# Altium schematic sheet CPU_CIRCUIT.SchDoc
size A4
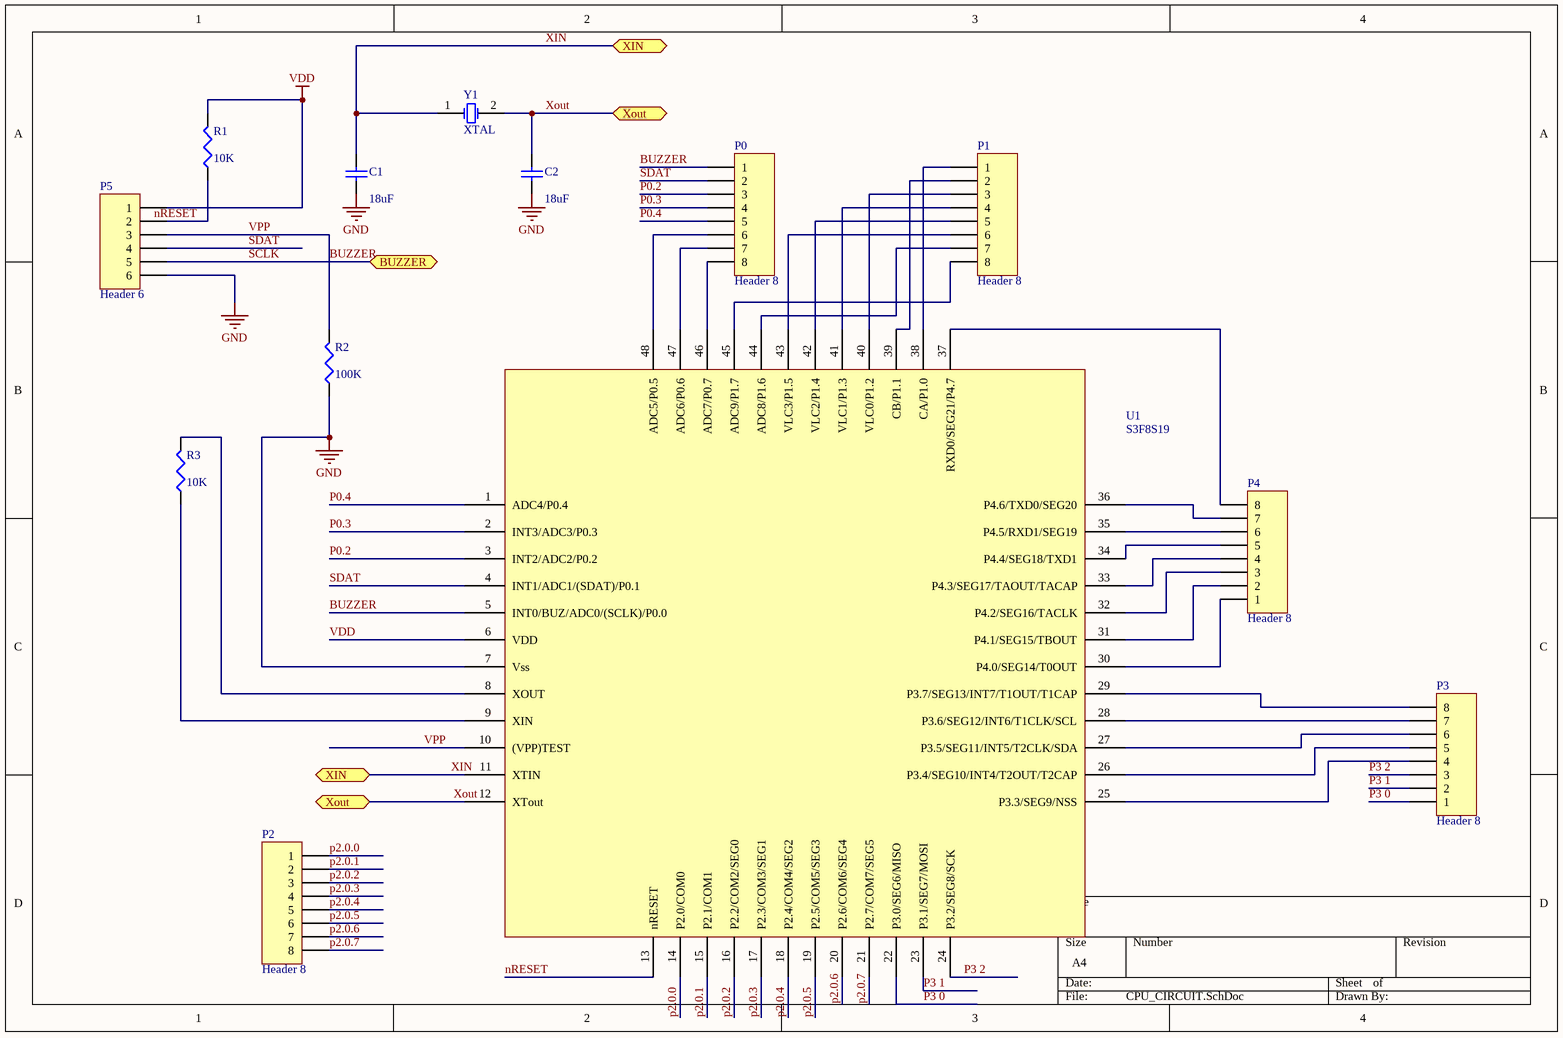
[diagram p0: CPU_CIRCUIT.SchDoc]

## Parts
C1  value 18uF  [1608[0603]]  (hidden comment: Cap Semi)
C2  value 18uF  [1608[0603]]  (hidden comment: Cap Semi)
P0  Header 8  [HDR1X8]
P1  Header 8  [HDR1X8]
P2  Header 8  [HDR1X8]
P3  Header 8  [HDR1X8]
P4  Header 8  [HDR1X8]
P5  Header 6  [HDR1X6]
R1  value 10K  [J1-0603]  (hidden comment: Res3)
R2  value 100K  [J1-0603]  (hidden comment: Res3)
R3  value 10K  [J1-0603]  (hidden comment: Res3)
U1  S3F8S19  [QFP75P1335X1335X230-48N]
Y1  XTAL  [R38]

## Ports
BUZZER, XIN, Xout

## Nets
GND: C1.1 C2.1 P5.6 R2.1 U1.7(Vss)
VDD: P5.1 R1.2 U1.6(VDD)
BUZZER: P0.1 P5.3 P5.5 R2.2 U1.5(INT0/BUZ/ADC0/(SCLK)/P0.0) U1.10((VPP)TEST) ; port BUZZER  [also labelled SCLK, VPP]
nRESET: U1.13(nRESET)
P0.2: P0.3 U1.3(INT2/ADC2/P0.2)
P0.3: P0.4 U1.2(INT3/ADC3/P0.3)
P0.4: P0.5 U1.1(ADC4/P0.4)
p2.0.0: P2.1 U1.14(P2.0/COM0)
p2.0.1: P2.2 U1.15(P2.1/COM1)
p2.0.2: P2.3 U1.16(P2.2/COM2/SEG0)
p2.0.3: P2.4 U1.17(P2.3/COM3/SEG1)
p2.0.4: P2.5 U1.18(P2.4/COM4/SEG2)
p2.0.5: P2.6 U1.19(P2.5/COM5/SEG3)
p2.0.6: P2.7 U1.20(P2.6/COM6/SEG4)
p2.0.7: P2.8 U1.21(P2.7/COM7/SEG5)
P3 0: P3.1 U1.22(P3.0/SEG6/MISO)
P3 1: P3.2 U1.23(P3.1/SEG7/MOSI)
P3 2: P3.3 U1.24(P3.2/SEG8/SCK)
SDAT: P0.2 P5.4 U1.4(INT1/ADC1/(SDAT)/P0.1)
XIN: C1.2 U1.11(XTIN) Y1.1(OSC1) ; port XIN
Xout: C2.2 U1.12(XTout) Y1.2(OSC2) ; port Xout
NetP0_6: P0.6 U1.48(ADC5/P0.5)
NetP0_7: P0.7 U1.47(ADC6/P0.6)
NetP0_8: P0.8 U1.46(ADC7/P0.7)
NetP1_1: P1.1 U1.38(CA/P1.0)
NetP1_2: P1.2 U1.39(CB/P1.1)
NetP1_3: P1.3 U1.40(VLC0/P1.2)
NetP1_4: P1.4 U1.41(VLC1/P1.3)
NetP1_5: P1.5 U1.42(VLC2/P1.4)
NetP1_6: P1.6 U1.43(VLC3/P1.5)
NetP1_7: P1.7 U1.44(ADC8/P1.6)
NetP1_8: P1.8 U1.45(ADC9/P1.7)
NetP3_4: P3.4 U1.25(P3.3/SEG9/NSS)
NetP3_5: P3.5 U1.26(P3.4/SEG10/INT4/T2OUT/T2CAP)
NetP3_6: P3.6 U1.27(P3.5/SEG11/INT5/T2CLK/SDA)
NetP3_7: P3.7 U1.28(P3.6/SEG12/INT6/T1CLK/SCL)
NetP3_8: P3.8 U1.29(P3.7/SEG13/INT7/T1OUT/T1CAP)
NetP4_1: P4.1 U1.30(P4.0/SEG14/T0OUT)
NetP4_2: P4.2 U1.31(P4.1/SEG15/TBOUT)
NetP4_3: P4.3 U1.32(P4.2/SEG16/TACLK)
NetP4_4: P4.4 U1.33(P4.3/SEG17/TAOUT/TACAP)
NetP4_5: P4.5 U1.34(P4.4/SEG18/TXD1)
NetP4_6: P4.6 U1.35(P4.5/RXD1/SEG19)
NetP4_7: P4.7 U1.36(P4.6/TXD0/SEG20)
NetP4_8: P4.8 U1.37(RXD0/SEG21/P4.7)
NetP5_2: P5.2 R1.1
NetR3_1: R3.1 U1.9(XIN)
NetR3_2: R3.2 U1.8(XOUT)

## Notes on the sheet
- Labels drawn without touching a wire or pin: nRESET

## Library data of the parts
C1 C2 = Cap Semi: Capacitor (Semiconductor SIM Model); Published: 8-Jun-2000; LatestRevisionDate: 29-May-2009; LatestRevisionNote: IPC-7351 Footprint Added.; PackageReference: C1206; Publisher: Altium Limited; PackageDescription: Chip Capacitor
P0-P4 = Header 8: Header, 8-Pin; LatestRevisionDate: 17-Jul-2002; LatestRevisionNote: Re-released for DXP Platform.; Publisher: Altium Limited
P5 = Header 6: Header, 6-Pin; LatestRevisionDate: 17-Jul-2002; LatestRevisionNote: Re-released for DXP Platform.; Publisher: Altium Limited
R1-R3 = Res3: Resistor; Published: 8-Jun-2000; LatestRevisionDate: 29-May-2009; LatestRevisionNote: IPC-7351 Footprint Added.; PackageReference: J1-0603; Publisher: Altium Limited; PackageDescription: Chip Resistor
Y1 = XTAL: Crystal Oscillator; Published: 8-Jun-2000; LatestRevisionDate: 17-Jul-2002; LatestRevisionNote: Re-released for DXP Platform.; PackageReference: R38; Publisher: Altium Limited; PackageDescription: Crystal, Thru-Hole; 2 Leads; Body 3.1 x 8.2 mm (Dia.xH)